# Altium schematic sheet ZYNQ_BANK.SchDoc
size 558 x 431 mm
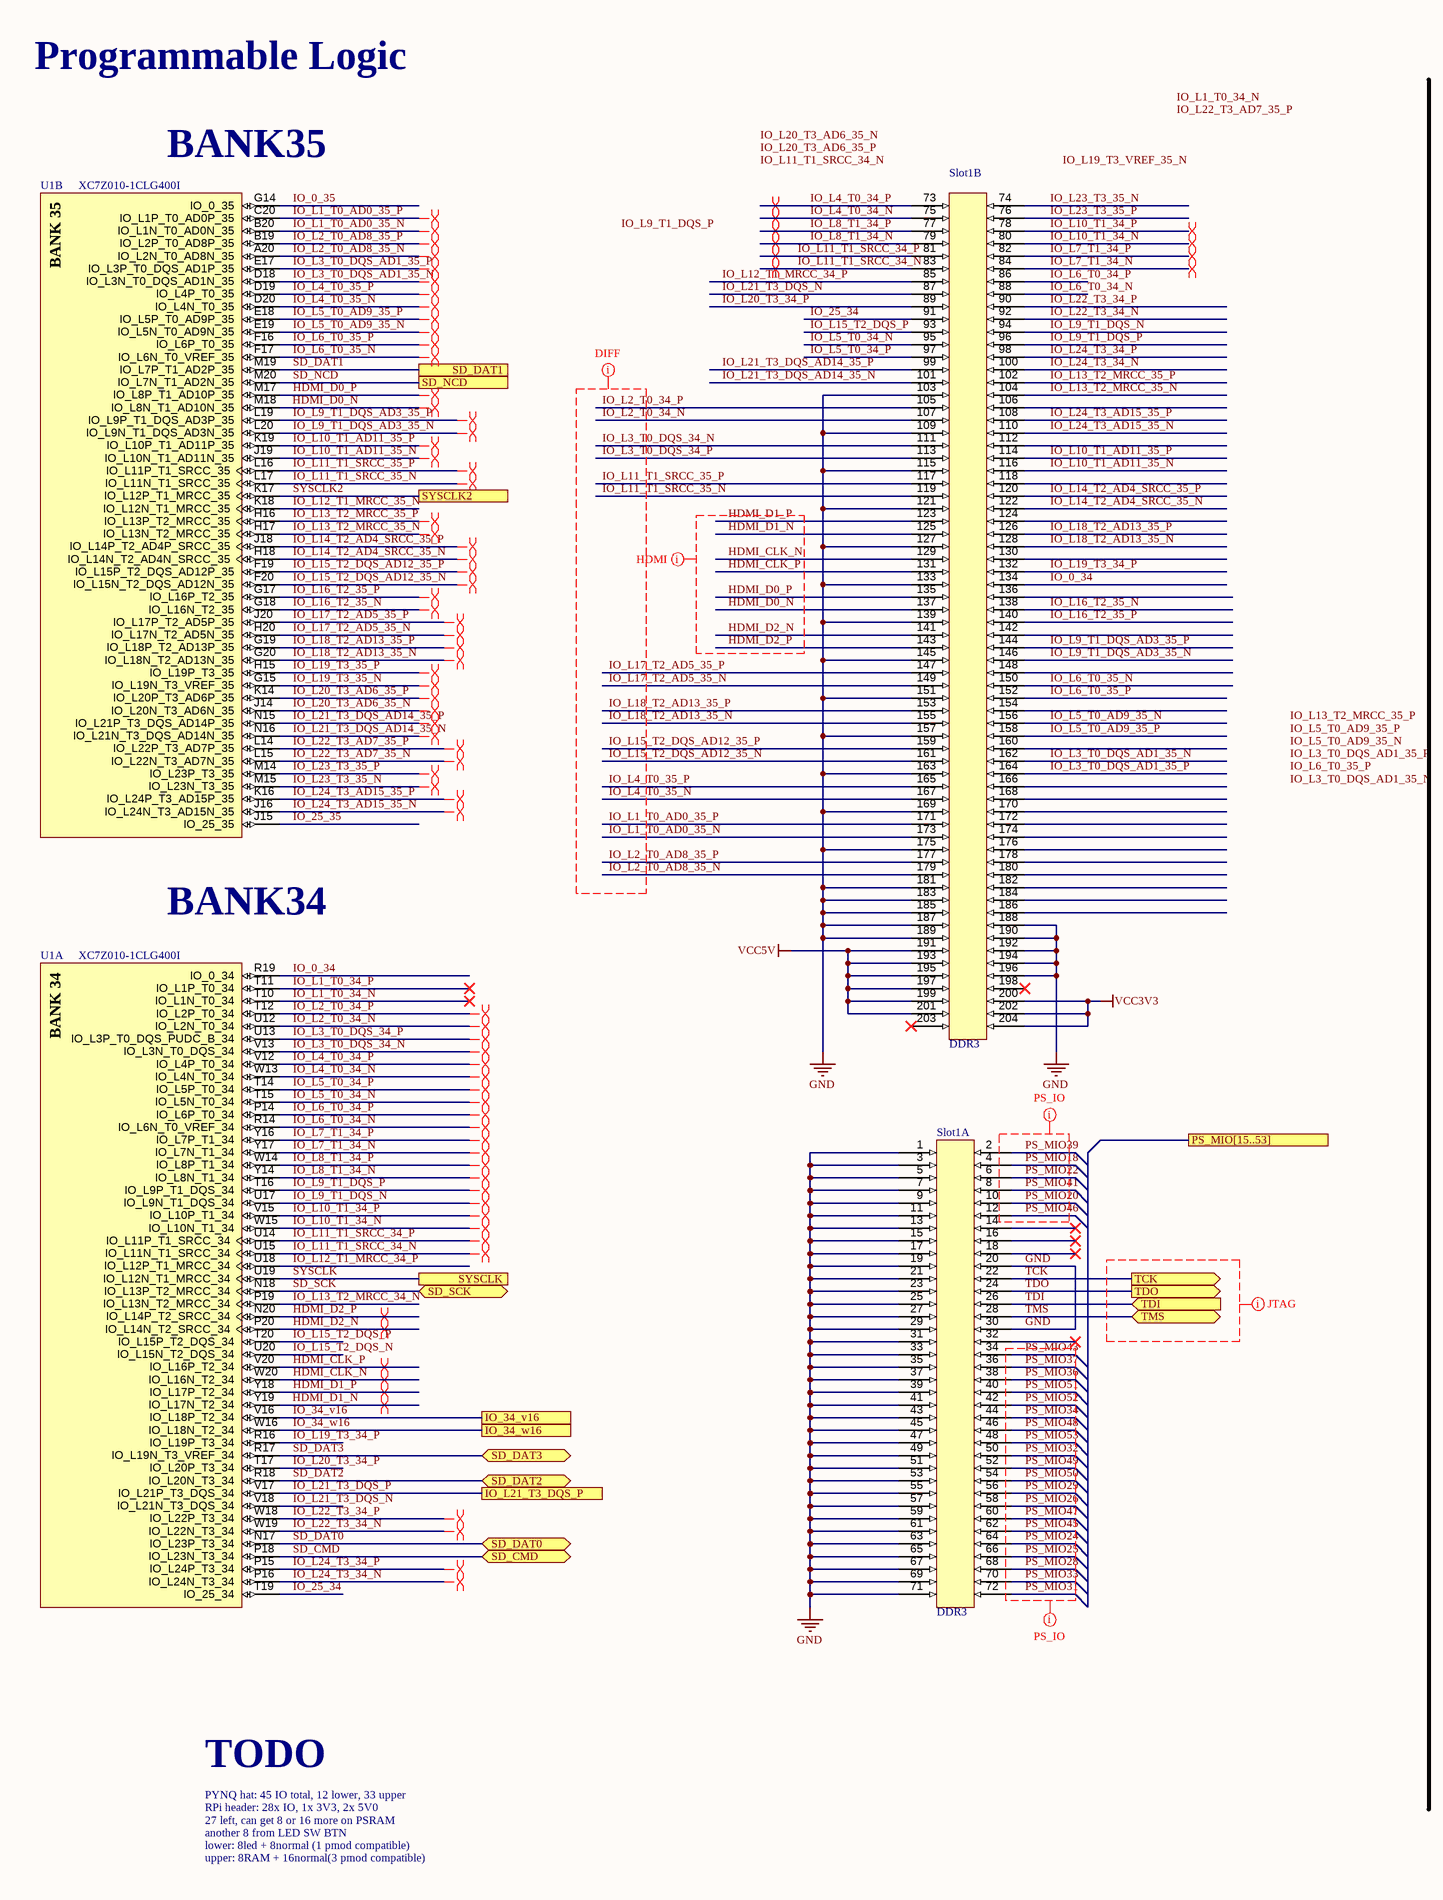
[diagram p0: ZYNQ_BANK.SchDoc, left]
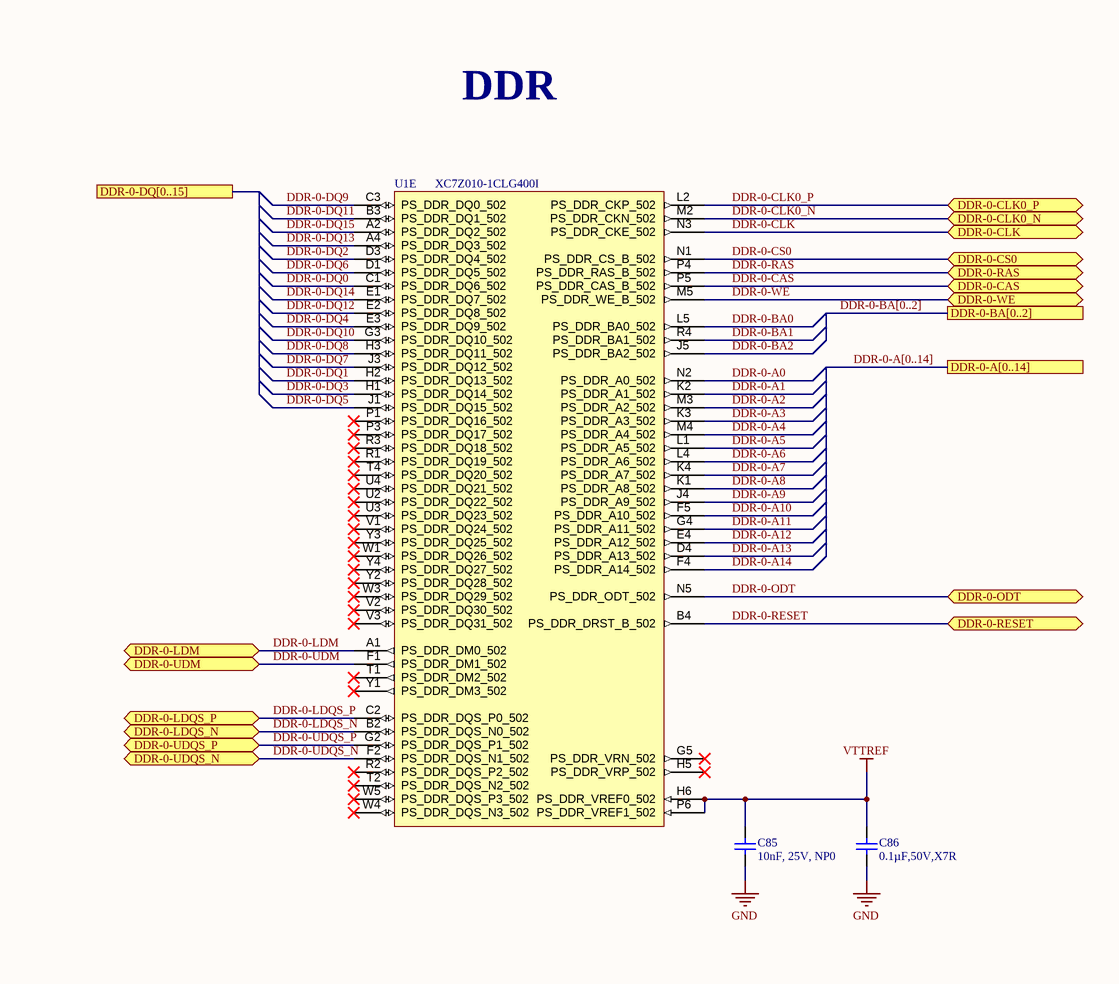
[diagram p1: ZYNQ_BANK.SchDoc, right]

## Parts
C85  value 10nF, 25V, NP0  [CAP0402i]  (hidden comment: 10nF)
C86  value 0.1µF,50V,X7R  [CAP0402i]  (hidden comment: 0.1µF)
Slot1  DDR3  [SODIMM_DDR3_EDGE]  (parts A,B of 2)  (no BOM)
U1  XC7Z010-1CLG400I  [CLG400]  (parts A,B,E of 9)

## Ports
DDR-0-A[0..14], DDR-0-BA[0..2], DDR-0-CAS (bidir), DDR-0-CLK0_N (bidir), DDR-0-CLK0_P (bidir), DDR-0-CLK (bidir), DDR-0-CS0 (bidir), DDR-0-DQ[0..15], DDR-0-LDM (bidir), DDR-0-LDQS_N (bidir), DDR-0-LDQS_P (bidir), DDR-0-ODT (bidir), DDR-0-RAS (bidir), DDR-0-RESET (bidir), DDR-0-UDM (bidir), DDR-0-UDQS_N (bidir), DDR-0-UDQS_P (bidir), DDR-0-WE (bidir), IO_34_v16, IO_34_w16, IO_L21_T3_DQS_P, PS_MIO[15..53], SD_CMD (bidir), SD_DAT0 (bidir), SD_DAT1, SD_DAT2 (bidir), SD_DAT3 (bidir), SD_NCD, SD_SCK (bidir), SYSCLK, SYSCLK2, TCK (out), TDI (in), TDO (out), TMS (bidir)

## Nets
GND: C85.1 C86.1 Slot1.1 Slot1.3 Slot1.5 Slot1.7 Slot1.9 Slot1.11 Slot1.13 Slot1.15 Slot1.17 Slot1.19 Slot1.20 Slot1.21 Slot1.23 Slot1.25 Slot1.27 Slot1.29 Slot1.30 Slot1.31 Slot1.33 Slot1.35 Slot1.37 Slot1.39 Slot1.41 Slot1.43 Slot1.45 Slot1.47 Slot1.49 Slot1.51 Slot1.53 Slot1.55 Slot1.57 Slot1.59 Slot1.61 Slot1.63 Slot1.65 Slot1.67 Slot1.69 Slot1.71 Slot1.103 Slot1.109 Slot1.115 Slot1.121 Slot1.127 Slot1.133 Slot1.139 Slot1.145 Slot1.151 Slot1.157 Slot1.163 Slot1.169 Slot1.175 Slot1.181 Slot1.183 Slot1.185 Slot1.187 Slot1.188 Slot1.189 Slot1.190 Slot1.192 Slot1.194 Slot1.196
VCC3V3: Slot1.200 Slot1.202 Slot1.204
VCC5V: Slot1.191 Slot1.193 Slot1.195 Slot1.197 Slot1.199 Slot1.201
VTTREF: C85.2 C86.2 U1.H6(PS_DDR_VREF0_502) U1.P6(PS_DDR_VREF1_502)
DDR-0-A0: U1.N2(PS_DDR_A0_502)
DDR-0-A1: U1.K2(PS_DDR_A1_502)
DDR-0-A2: U1.M3(PS_DDR_A2_502)
DDR-0-A3: U1.K3(PS_DDR_A3_502)
DDR-0-A4: U1.M4(PS_DDR_A4_502)
DDR-0-A5: U1.L1(PS_DDR_A5_502)
DDR-0-A6: U1.L4(PS_DDR_A6_502)
DDR-0-A7: U1.K4(PS_DDR_A7_502)
DDR-0-A8: U1.K1(PS_DDR_A8_502)
DDR-0-A9: U1.J4(PS_DDR_A9_502)
DDR-0-A10: U1.F5(PS_DDR_A10_502)
DDR-0-A11: U1.G4(PS_DDR_A11_502)
DDR-0-A12: U1.E4(PS_DDR_A12_502)
DDR-0-A13: U1.D4(PS_DDR_A13_502)
DDR-0-A14: U1.F4(PS_DDR_A14_502)
DDR-0-BA0: U1.L5(PS_DDR_BA0_502)
DDR-0-BA1: U1.R4(PS_DDR_BA1_502)
DDR-0-BA2: U1.J5(PS_DDR_BA2_502)
DDR-0-CAS: U1.P5(PS_DDR_CAS_B_502) ; port DDR-0-CAS
DDR-0-CLK: U1.N3(PS_DDR_CKE_502) ; port DDR-0-CLK
DDR-0-CLK0_N: U1.M2(PS_DDR_CKN_502) ; port DDR-0-CLK0_N
DDR-0-CLK0_P: U1.L2(PS_DDR_CKP_502) ; port DDR-0-CLK0_P
DDR-0-CS0: U1.N1(PS_DDR_CS_B_502) ; port DDR-0-CS0
DDR-0-DQ0: U1.C1(PS_DDR_DQ6_502)
DDR-0-DQ1: U1.H2(PS_DDR_DQ13_502)
DDR-0-DQ2: U1.D3(PS_DDR_DQ4_502)
DDR-0-DQ3: U1.H1(PS_DDR_DQ14_502)
DDR-0-DQ4: U1.E3(PS_DDR_DQ9_502)
DDR-0-DQ5: U1.J1(PS_DDR_DQ15_502)
DDR-0-DQ6: U1.D1(PS_DDR_DQ5_502)
DDR-0-DQ7: U1.J3(PS_DDR_DQ12_502)
DDR-0-DQ8: U1.H3(PS_DDR_DQ11_502)
DDR-0-DQ9: U1.C3(PS_DDR_DQ0_502)
DDR-0-DQ10: U1.G3(PS_DDR_DQ10_502)
DDR-0-DQ11: U1.B3(PS_DDR_DQ1_502)
DDR-0-DQ12: U1.E2(PS_DDR_DQ8_502)
DDR-0-DQ13: U1.A4(PS_DDR_DQ3_502)
DDR-0-DQ14: U1.E1(PS_DDR_DQ7_502)
DDR-0-DQ15: U1.A2(PS_DDR_DQ2_502)
DDR-0-LDM: U1.A1(PS_DDR_DM0_502) ; port DDR-0-LDM
DDR-0-LDQS_N: U1.B2(PS_DDR_DQS_N0_502) ; port DDR-0-LDQS_N
DDR-0-LDQS_P: U1.C2(PS_DDR_DQS_P0_502) ; port DDR-0-LDQS_P
DDR-0-ODT: U1.N5(PS_DDR_ODT_502) ; port DDR-0-ODT
DDR-0-RAS: U1.P4(PS_DDR_RAS_B_502) ; port DDR-0-RAS
DDR-0-RESET: U1.B4(PS_DDR_DRST_B_502) ; port DDR-0-RESET
DDR-0-UDM: U1.F1(PS_DDR_DM1_502) ; port DDR-0-UDM
DDR-0-UDQS_N: U1.F2(PS_DDR_DQS_N1_502) ; port DDR-0-UDQS_N
DDR-0-UDQS_P: U1.G2(PS_DDR_DQS_P1_502) ; port DDR-0-UDQS_P
DDR-0-WE: U1.M5(PS_DDR_WE_B_502) ; port DDR-0-WE
HDMI_CLK_N: Slot1.129 U1.W20(IO_L16N_T2_34)
HDMI_CLK_P: Slot1.131 U1.V20(IO_L16P_T2_34)
HDMI_D0_N: Slot1.137 U1.M18(IO_L8N_T1_AD10N_35)
HDMI_D0_P: Slot1.135 U1.M17(IO_L8P_T1_AD10P_35)
HDMI_D1_N: Slot1.125 U1.Y19(IO_L17N_T2_34)
HDMI_D1_P: Slot1.123 U1.Y18(IO_L17P_T2_34)
HDMI_D2_N: Slot1.141 U1.P20(IO_L14N_T2_SRCC_34)
HDMI_D2_P: Slot1.143 U1.N20(IO_L14P_T2_SRCC_34)
IO_0_34: Slot1.134 U1.R19(IO_0_34)
IO_0_35: U1.G14(IO_0_35)
IO_25_34: Slot1.91 U1.T19(IO_25_34)
IO_25_35: U1.J15(IO_25_35)
IO_34_v16: U1.V16(IO_L18P_T2_34) ; port IO_34_v16
IO_34_w16: U1.W16(IO_L18N_T2_34) ; port IO_34_w16
IO_L1_T0_34_N: U1.T10(IO_L1N_T0_34)
IO_L1_T0_34_P: U1.T11(IO_L1P_T0_34)
IO_L1_T0_AD0_35_N: Slot1.173 U1.B20(IO_L1N_T0_AD0N_35)
IO_L1_T0_AD0_35_P: Slot1.171 U1.C20(IO_L1P_T0_AD0P_35)
IO_L2_T0_34_N: Slot1.107 U1.U12(IO_L2N_T0_34)
IO_L2_T0_34_P: Slot1.105 U1.T12(IO_L2P_T0_34)
IO_L2_T0_AD8_35_N: Slot1.179 U1.A20(IO_L2N_T0_AD8N_35)
IO_L2_T0_AD8_35_P: Slot1.177 U1.B19(IO_L2P_T0_AD8P_35)
IO_L3_T0_DQS_34_N: Slot1.111 U1.V13(IO_L3N_T0_DQS_34)
IO_L3_T0_DQS_34_P: Slot1.113 U1.U13(IO_L3P_T0_DQS_PUDC_B_34)
IO_L3_T0_DQS_AD1_35_N: Slot1.162 U1.D18(IO_L3N_T0_DQS_AD1N_35)
IO_L3_T0_DQS_AD1_35_P: Slot1.164 U1.E17(IO_L3P_T0_DQS_AD1P_35)
IO_L4_T0_34_N: Slot1.75 U1.W13(IO_L4N_T0_34)
IO_L4_T0_34_P: Slot1.73 U1.V12(IO_L4P_T0_34)
IO_L4_T0_35_N: Slot1.167 U1.D20(IO_L4N_T0_35)
IO_L4_T0_35_P: Slot1.165 U1.D19(IO_L4P_T0_35)
IO_L5_T0_34_N: Slot1.95 U1.T15(IO_L5N_T0_34)
IO_L5_T0_34_P: Slot1.97 U1.T14(IO_L5P_T0_34)
IO_L5_T0_AD9_35_N: Slot1.156 U1.E19(IO_L5N_T0_AD9N_35)
IO_L5_T0_AD9_35_P: Slot1.158 U1.E18(IO_L5P_T0_AD9P_35)
IO_L6_T0_34_N: Slot1.88 U1.R14(IO_L6N_T0_VREF_34)
IO_L6_T0_34_P: Slot1.86 U1.P14(IO_L6P_T0_34)
IO_L6_T0_35_N: Slot1.150 U1.F17(IO_L6N_T0_VREF_35)
IO_L6_T0_35_P: Slot1.152 U1.F16(IO_L6P_T0_35)
IO_L7_T1_34_N: Slot1.84 U1.Y17(IO_L7N_T1_34)
IO_L7_T1_34_P: Slot1.82 U1.Y16(IO_L7P_T1_34)
IO_L8_T1_34_N: Slot1.79 U1.Y14(IO_L8N_T1_34)
IO_L8_T1_34_P: Slot1.77 U1.W14(IO_L8P_T1_34)
IO_L9_T1_DQS_AD3_35_N: Slot1.146 U1.L20(IO_L9N_T1_DQS_AD3N_35)
IO_L9_T1_DQS_AD3_35_P: Slot1.144 U1.L19(IO_L9P_T1_DQS_AD3P_35)
IO_L9_T1_DQS_N: Slot1.94 U1.U17(IO_L9N_T1_DQS_34)
IO_L9_T1_DQS_P: Slot1.96 U1.T16(IO_L9P_T1_DQS_34)
IO_L10_T1_34_N: Slot1.80 U1.W15(IO_L10N_T1_34)
IO_L10_T1_34_P: Slot1.78 U1.V15(IO_L10P_T1_34)
IO_L10_T1_AD11_35_N: Slot1.116 U1.J19(IO_L10N_T1_AD11N_35)
IO_L10_T1_AD11_35_P: Slot1.114 U1.K19(IO_L10P_T1_AD11P_35)
IO_L11_T1_SRCC_34_N: Slot1.83 U1.U15(IO_L11N_T1_SRCC_34)
IO_L11_T1_SRCC_34_P: Slot1.81 U1.U14(IO_L11P_T1_SRCC_34)
IO_L11_T1_SRCC_35_N: Slot1.119 U1.L17(IO_L11N_T1_SRCC_35)
IO_L11_T1_SRCC_35_P: Slot1.117 U1.L16(IO_L11P_T1_SRCC_35)
IO_L12_T1_MRCC_34_P: Slot1.85 U1.U18(IO_L12P_T1_MRCC_34)
IO_L12_T1_MRCC_35_N: U1.K18(IO_L12N_T1_MRCC_35)
IO_L13_T2_MRCC_34_N: U1.P19(IO_L13N_T2_MRCC_34)
IO_L13_T2_MRCC_35_N: Slot1.104 U1.H17(IO_L13N_T2_MRCC_35)
IO_L13_T2_MRCC_35_P: Slot1.102 U1.H16(IO_L13P_T2_MRCC_35)
IO_L14_T2_AD4_SRCC_35_N: Slot1.122 U1.H18(IO_L14N_T2_AD4N_SRCC_35)
IO_L14_T2_AD4_SRCC_35_P: Slot1.120 U1.J18(IO_L14P_T2_AD4P_SRCC_35)
IO_L15_T2_DQS_AD12_35_N: Slot1.161 U1.F20(IO_L15N_T2_DQS_AD12N_35)
IO_L15_T2_DQS_AD12_35_P: Slot1.159 U1.F19(IO_L15P_T2_DQS_AD12P_35)
IO_L15_T2_DQS_N: U1.U20(IO_L15N_T2_DQS_34)
IO_L15_T2_DQS_P: Slot1.93 U1.T20(IO_L15P_T2_DQS_34)
IO_L16_T2_35_N: Slot1.138 U1.G18(IO_L16N_T2_35)
IO_L16_T2_35_P: Slot1.140 U1.G17(IO_L16P_T2_35)
IO_L17_T2_AD5_35_N: Slot1.149 U1.H20(IO_L17N_T2_AD5N_35)
IO_L17_T2_AD5_35_P: Slot1.147 U1.J20(IO_L17P_T2_AD5P_35)
IO_L18_T2_AD13_35_N: Slot1.128 Slot1.155 U1.G20(IO_L18N_T2_AD13N_35)
IO_L18_T2_AD13_35_P: Slot1.126 Slot1.153 U1.G19(IO_L18P_T2_AD13P_35)
IO_L19_T3_34_P: Slot1.132 U1.R16(IO_L19P_T3_34)
IO_L19_T3_35_N: U1.G15(IO_L19N_T3_VREF_35)
IO_L19_T3_35_P: U1.H15(IO_L19P_T3_35)
IO_L20_T3_34_P: Slot1.89 U1.T17(IO_L20P_T3_34)
IO_L20_T3_AD6_35_N: U1.J14(IO_L20N_T3_AD6N_35)
IO_L20_T3_AD6_35_P: U1.K14(IO_L20P_T3_AD6P_35)
IO_L21_T3_DQS_AD14_35_N: Slot1.101 U1.N16(IO_L21N_T3_DQS_AD14N_35)
IO_L21_T3_DQS_AD14_35_P: Slot1.99 U1.N15(IO_L21P_T3_DQS_AD14P_35)
IO_L21_T3_DQS_N: Slot1.87 U1.V18(IO_L21N_T3_DQS_34)
IO_L21_T3_DQS_P: U1.V17(IO_L21P_T3_DQS_34) ; port IO_L21_T3_DQS_P
IO_L22_T3_34_N: Slot1.92 U1.W19(IO_L22N_T3_34)
IO_L22_T3_34_P: Slot1.90 U1.W18(IO_L22P_T3_34)
IO_L22_T3_AD7_35_N: U1.L15(IO_L22N_T3_AD7N_35)
IO_L22_T3_AD7_35_P: U1.L14(IO_L22P_T3_AD7P_35)
IO_L23_T3_35_N: Slot1.74 U1.M15(IO_L23N_T3_35)
IO_L23_T3_35_P: Slot1.76 U1.M14(IO_L23P_T3_35)
IO_L24_T3_34_N: Slot1.100 U1.P16(IO_L24N_T3_34)
IO_L24_T3_34_P: Slot1.98 U1.P15(IO_L24P_T3_34)
IO_L24_T3_AD15_35_N: Slot1.110 U1.J16(IO_L24N_T3_AD15N_35)
IO_L24_T3_AD15_35_P: Slot1.108 U1.K16(IO_L24P_T3_AD15P_35)
PS_MIO18: Slot1.4
PS_MIO20: Slot1.10
PS_MIO22: Slot1.6
PS_MIO24: Slot1.64
PS_MIO25: Slot1.66
PS_MIO26: Slot1.58
PS_MIO28: Slot1.68
PS_MIO29: Slot1.56
PS_MIO31: Slot1.72
PS_MIO32: Slot1.50
PS_MIO33: Slot1.70
PS_MIO34: Slot1.44
PS_MIO36: Slot1.38
PS_MIO37: Slot1.36
PS_MIO39: Slot1.2
PS_MIO41: Slot1.8
PS_MIO43: Slot1.34
PS_MIO45: Slot1.62
PS_MIO46: Slot1.12
PS_MIO47: Slot1.60
PS_MIO48: Slot1.46
PS_MIO49: Slot1.52
PS_MIO50: Slot1.54
PS_MIO51: Slot1.40
PS_MIO52: Slot1.42
PS_MIO53: Slot1.48
SD_CMD: U1.P18(IO_L23N_T3_34) ; port SD_CMD
SD_DAT0: U1.N17(IO_L23P_T3_34) ; port SD_DAT0
SD_DAT1: U1.M19(IO_L7P_T1_AD2P_35) ; port SD_DAT1
SD_DAT2: U1.R18(IO_L20N_T3_34) ; port SD_DAT2
SD_DAT3: U1.R17(IO_L19N_T3_VREF_34) ; port SD_DAT3
SD_NCD: U1.M20(IO_L7N_T1_AD2N_35) ; port SD_NCD
SD_SCK: U1.N18(IO_L13P_T2_MRCC_34) ; port SD_SCK
SYSCLK: U1.U19(IO_L12N_T1_MRCC_34) ; port SYSCLK
SYSCLK2: U1.K17(IO_L12P_T1_MRCC_35) ; port SYSCLK2
TCK: Slot1.22 ; port TCK
TDI: Slot1.26 ; port TDI
TDO: Slot1.24 ; port TDO
TMS: Slot1.28 ; port TMS

Not connected (* = marked no-connect by the designer): Slot1 14* 16* 18* 32* 106 112 118 124 130 136 142 148 154 160 166 168 170 172 174 176 178 180 182 184 186 198* 203*; U1 G5(PS_DDR_VRN_502)* H5(PS_DDR_VRP_502)* P1(PS_DDR_DQ16_502)* P3(PS_DDR_DQ17_502)* R1(PS_DDR_DQ19_502)* R2(PS_DDR_DQS_P2_502)* R3(PS_DDR_DQ18_502)* T1(PS_DDR_DM2_502)* T2(PS_DDR_DQS_N2_502)* T4(PS_DDR_DQ20_502)* U2(PS_DDR_DQ22_502)* U3(PS_DDR_DQ23_502)* U4(PS_DDR_DQ21_502)* V1(PS_DDR_DQ24_502)* V2(PS_DDR_DQ30_502)* V3(PS_DDR_DQ31_502)* W1(PS_DDR_DQ26_502)* W3(PS_DDR_DQ29_502)* W4(PS_DDR_DQS_N3_502)* W5(PS_DDR_DQS_P3_502)* Y1(PS_DDR_DM3_502)* Y2(PS_DDR_DQ28_502)* Y3(PS_DDR_DQ25_502)* Y4(PS_DDR_DQ27_502)*

## Buses and harness runs
bus DDR-0-A[0..14] = port DDR-0-A[0..14]
bus DDR-0-BA[0..2] = port DDR-0-BA[0..2]

## Layout directives
differential pair: HDMI_CLK_N, HDMI_CLK_P, HDMI_D0_N, HDMI_D0_P, HDMI_D1_N, HDMI_D1_P, HDMI_D2_N, HDMI_D2_P, IO_L1_T0_AD0_35_N, IO_L1_T0_AD0_35_P, IO_L2_T0_34_N, IO_L2_T0_34_P, IO_L2_T0_AD8_35_N, IO_L2_T0_AD8_35_P, IO_L3_T0_DQS_34_N, IO_L3_T0_DQS_34_P, IO_L3_T0_DQS_AD1_35_N, IO_L3_T0_DQS_AD1_35_P, IO_L4_T0_34_N, IO_L4_T0_34_P, IO_L4_T0_35_N, IO_L4_T0_35_P, IO_L5_T0_34_N, IO_L5_T0_34_P, IO_L5_T0_AD9_35_N, IO_L5_T0_AD9_35_P, IO_L6_T0_34_N, IO_L6_T0_34_P, IO_L6_T0_35_N, IO_L6_T0_35_P, IO_L7_T1_34_N, IO_L7_T1_34_P, IO_L8_T1_34_N, IO_L8_T1_34_P, IO_L9_T1_DQS_AD3_35_N, IO_L9_T1_DQS_AD3_35_P, IO_L9_T1_DQS_N, IO_L9_T1_DQS_P, IO_L10_T1_34_N, IO_L10_T1_34_P, IO_L10_T1_AD11_35_N, IO_L10_T1_AD11_35_P, IO_L11_T1_SRCC_34_N, IO_L11_T1_SRCC_34_P, IO_L11_T1_SRCC_35_N, IO_L11_T1_SRCC_35_P, IO_L13_T2_MRCC_35_N, IO_L13_T2_MRCC_35_P, IO_L14_T2_AD4_SRCC_35_N, IO_L14_T2_AD4_SRCC_35_P, IO_L15_T2_DQS_AD12_35_N, IO_L15_T2_DQS_AD12_35_P, IO_L16_T2_35_N, IO_L16_T2_35_P, IO_L17_T2_AD5_35_N, IO_L17_T2_AD5_35_P, IO_L18_T2_AD13_35_N, IO_L18_T2_AD13_35_P, IO_L19_T3_35_N, IO_L19_T3_35_P, IO_L20_T3_AD6_35_N, IO_L20_T3_AD6_35_P, IO_L21_T3_DQS_AD14_35_N, IO_L21_T3_DQS_AD14_35_P, IO_L22_T3_34_N, IO_L22_T3_34_P, IO_L22_T3_AD7_35_N, IO_L22_T3_AD7_35_P, IO_L23_T3_35_N, IO_L23_T3_35_P, IO_L24_T3_34_N, IO_L24_T3_34_P, IO_L24_T3_AD15_35_N, IO_L24_T3_AD15_35_P
net class HDMI: HDMI_CLK_N, HDMI_CLK_P, HDMI_D0_N, HDMI_D0_P, HDMI_D1_N, HDMI_D1_P, HDMI_D2_N, HDMI_D2_P
net class DIFF: IO_L1_T0_AD0_35_N, IO_L1_T0_AD0_35_P, IO_L2_T0_34_N, IO_L2_T0_34_P, IO_L2_T0_AD8_35_N, IO_L2_T0_AD8_35_P, IO_L3_T0_DQS_34_N, IO_L3_T0_DQS_34_P, IO_L4_T0_35_N, IO_L4_T0_35_P, IO_L11_T1_SRCC_35_N, IO_L11_T1_SRCC_35_P, IO_L15_T2_DQS_AD12_35_N, IO_L15_T2_DQS_AD12_35_P, IO_L17_T2_AD5_35_N, IO_L17_T2_AD5_35_P, IO_L18_T2_AD13_35_N, IO_L18_T2_AD13_35_P
net class JTAG: (no net found under the mark)
mark named PS_IO: PS_MIO18, PS_MIO20, PS_MIO22, PS_MIO24, PS_MIO25, PS_MIO26, PS_MIO28, PS_MIO29, PS_MIO31, PS_MIO32, PS_MIO33, PS_MIO34, PS_MIO36, PS_MIO37, PS_MIO39, PS_MIO41, PS_MIO43, PS_MIO45, PS_MIO46, PS_MIO47, PS_MIO48, PS_MIO49, PS_MIO50, PS_MIO51, PS_MIO52, PS_MIO53

## Notes on the sheet
- Programmable Logic
- (near U1) BANK35
- DDR
- BANK34
- PYNQ hat: 45 IO total, 12 lower, 33 upper
- TODO
- 27 left, can get 8 or 16 more on PSRAM
- another 8 from LED SW BTN
- lower: 8led + 8normal (1 pmod compatible)
- upper: 8RAM + 16normal(3 pmod compatible)
- RPi header: 28x IO, 1x 3V3, 2x 5V0
- Labels drawn without touching a wire or pin: IO_L1_T0_34_N, IO_L3_T0_DQS_AD1_35_N, IO_L3_T0_DQS_AD1_35_P, IO_L5_T0_AD9_35_N, IO_L5_T0_AD9_35_P, IO_L6_T0_35_P, IO_L9_T1_DQS_P, IO_L11_T1_SRCC_34_N, IO_L13_T2_MRCC_35_P, IO_L19_T3_VREF_35_N, IO_L20_T3_AD6_35_N, IO_L20_T3_AD6_35_P, IO_L22_T3_AD7_35_P
- DWG. NO.
- REV.
- SHT.
- REVISION
- DESCRIPTION
- DATE
- APPROVED
- THIS DOCUMENT AND THE DATA DISCLOSED HEREIN OR HEREWITH IS THE PROPERTY OF ALTIUM LIMITED AND MAY BE FREELY DISTRIBUTED IN WHOLE. NO RIGHTS ARE RESERVED OR EXPRESS OR IMPLIED WARANTEE GIVEN.
- ENG:
- DSN:
- APPROVALS
- PROJECT
- DOCUMENT REVISION:
- DESIGN ITEM:
- CHK:
- BOM:
- REFERENCE DOCUMENTS
- PROJECT REVISION:
- TITLE
- FAB DWG:
- PCB DWG:
- ASSY DWG:
- SCALE:
- SIZE
- C
- CAGE CODE
- FILE NAME
- DWG NO.
- SHEET
- OF
- REV
- (in symbol XC7Z010-1CLG400I, part A) BANK 34
- (in symbol XC7Z010-1CLG400I, part B) BANK 35

## Library data of the parts
C85 = Cap_10nF_25V_NP0_0402: 0402,10nF,5%,25V,NP0; Part Number: GRM1555C1E103JE01J; Manufacturer: Murata; Type: Ceramic; Voltage: 25V; Temperature Coefficient: NP0; Tolerance: ±5%; Operating Temperature: -55°C ~ 125°C; Mounting Type: SMT; Package: 0402 (1005 Metric); Supplier 1: Mouser; Supplier Part Number 1: 81-GRM1555C1E103JE1J; Manufacturer Part Number 1: GRM1555C1E103JE01J; Component Type: Generic; Capacitance: 10nF; Note: *; Supplier 2: DigiKey; Supplier 3: Farnell; Supplier Part Number 2: *; Supplier Part Number 3: *
C86 = Cap_0.1uF_50V_X7R_0402: 0402, 0.1uF, 10%,  50V, X7R; Part Number: C1005X7R1H104K050BE; Manufacturer 1: TDK; Type: Ceramic; Voltage: 50V; Temperature Coefficient: X7R; Tolerance: ±10%; Operating Temperature: -55°C ~ 125°C; Mounting Type: SMT; Package: 0402 (1005 Metric); Applications: Automotive; Ratings: AEC-Q200; Supplier 1: Mouser; Supplier Part Number 1: 810-C1005X7R1H104KBE; Manufacturer Part Number 1: C1005X7R1H104K050BE; Component Type: Generic; Capacitance: 0.1µF; Note: *; Supplier 2: DigiKey; Supplier 3: Farnell; Supplier Part Number 2: 445-173610-1-ND; Supplier Part Number 3: 3416071
Slot1 = Slot_DDR3
U1 = XC7Z010-1CLG400I: 667 MHz Zynq?7000 AP SoC, 130 PS I/O, 100 FPGA I/O, 400-Ball BGA, Speed Grade 1, Industrial Grade, Pb-Free; Manufacturer: Xilinx; Extensible Block RAM (# 36Kb Blocks): 240 KB (60); Flip Flops: 35200; LUTs: 17600; Speed Grade: -1; DatasheetVersion: v1.2; PackageVersion: Rev 1.1; PackageReference: CLG400; PackageDescription: Wire-Bond Chip-Scale BGA, Body 17 x 17 mm, 0.8 mm Pitch; Generic Part Number: XC7Z010; RoHS: Pb-Free; Mounting Technology: Surface Mount; Code_JEDEC: MO-275-MMAA-1; PartNumber: XC7Z010-1CLG400I; ComponentLink1Description: Datasheet; ComponentLink1URL: http://www.xilinx.com/support/documentation/data_sheets/ds190-Zynq-7000-Overview.pdf; ComponentLink2Description: Package Specification; ComponentLink2URL: http://www.xilinx.com/support/documentation/user_guides/ug865-Zynq-7000-Pkg-Pinout.pdf; ComponentLink3Description: DC and AC Switching Characteristics; ComponentLink3URL: http://www.xilinx.com/support/documentation/data_sheets/ds187-XC7Z010-XC7Z020-Data-Sheet.pdf; ComponentLink4Description: Package File; ComponentLink4URL: http://www.xilinx.com/support/packagefiles/z7packages/xc7z010clg400pkg.txt; ComponentLink5Description: Packaging and Pinout; ComponentLink5URL: http://www.xilinx.com/support/documentation/user_guides/ug865-Zynq-7000-Pkg-Pinout.pdf; ComponentLink6Description: PCB and Layout Guide; ComponentLink6URL: http://www.xilinx.com/support/documentation/user_guides/ug483_7Series_PCB.pdf